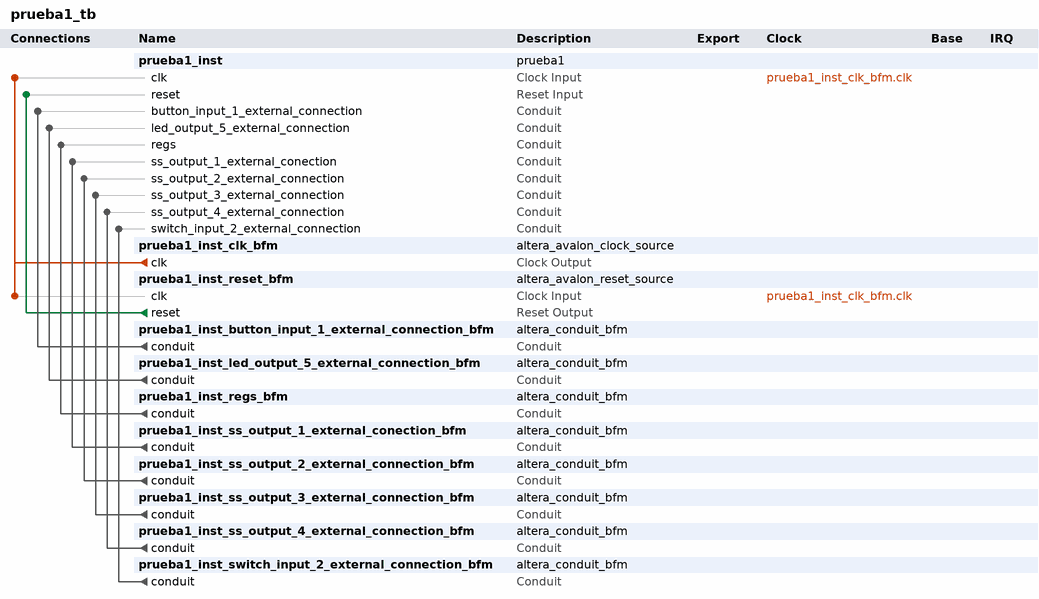
[diagram p0: system contents]
# Platform Designer (Qsys) system prueba1_tb, Cyclone V 5CEBA2F17A7
# Parameters at their usual value, and those the tool derives, are not listed.
package require -exact qsys 19.1
create_system prueba1_tb
set_project_property DEVICE_FAMILY {Cyclone V}
set_project_property DEVICE 5CEBA2F17A7

add_instance prueba1_inst prueba1 1.0

add_instance prueba1_inst_clk_bfm altera_avalon_clock_source 19.1

add_instance prueba1_inst_reset_bfm altera_avalon_reset_source 19.1
set_instance_parameter_value prueba1_inst_reset_bfm ASSERT_HIGH_RESET 0
set_instance_parameter_value prueba1_inst_reset_bfm INITIAL_RESET_CYCLES 50

add_instance prueba1_inst_button_input_1_external_connection_bfm altera_conduit_bfm 19.1
set_instance_parameter_value prueba1_inst_button_input_1_external_connection_bfm CLOCKED_SIGNAL false
set_instance_parameter_value prueba1_inst_button_input_1_external_connection_bfm ENABLE_RESET false
set_instance_parameter_value prueba1_inst_button_input_1_external_connection_bfm SIGNAL_DIRECTIONS output
set_instance_parameter_value prueba1_inst_button_input_1_external_connection_bfm SIGNAL_WIDTHS 3

add_instance prueba1_inst_led_output_5_external_connection_bfm altera_conduit_bfm 19.1
set_instance_parameter_value prueba1_inst_led_output_5_external_connection_bfm CLOCKED_SIGNAL false
set_instance_parameter_value prueba1_inst_led_output_5_external_connection_bfm ENABLE_RESET false
set_instance_parameter_value prueba1_inst_led_output_5_external_connection_bfm SIGNAL_DIRECTIONS input
set_instance_parameter_value prueba1_inst_led_output_5_external_connection_bfm SIGNAL_WIDTHS 8

add_instance prueba1_inst_regs_bfm altera_conduit_bfm 19.1
set_instance_parameter_value prueba1_inst_regs_bfm CLOCKED_SIGNAL false
set_instance_parameter_value prueba1_inst_regs_bfm ENABLE_RESET false
set_instance_parameter_value prueba1_inst_regs_bfm SIGNAL_DIRECTIONS input
set_instance_parameter_value prueba1_inst_regs_bfm SIGNAL_WIDTHS 8

add_instance prueba1_inst_ss_output_1_external_conection_bfm altera_conduit_bfm 19.1
set_instance_parameter_value prueba1_inst_ss_output_1_external_conection_bfm CLOCKED_SIGNAL false
set_instance_parameter_value prueba1_inst_ss_output_1_external_conection_bfm ENABLE_RESET false
set_instance_parameter_value prueba1_inst_ss_output_1_external_conection_bfm SIGNAL_DIRECTIONS input
set_instance_parameter_value prueba1_inst_ss_output_1_external_conection_bfm SIGNAL_WIDTHS 8

add_instance prueba1_inst_ss_output_2_external_connection_bfm altera_conduit_bfm 19.1
set_instance_parameter_value prueba1_inst_ss_output_2_external_connection_bfm CLOCKED_SIGNAL false
set_instance_parameter_value prueba1_inst_ss_output_2_external_connection_bfm ENABLE_RESET false
set_instance_parameter_value prueba1_inst_ss_output_2_external_connection_bfm SIGNAL_DIRECTIONS input
set_instance_parameter_value prueba1_inst_ss_output_2_external_connection_bfm SIGNAL_WIDTHS 8

add_instance prueba1_inst_ss_output_3_external_connection_bfm altera_conduit_bfm 19.1
set_instance_parameter_value prueba1_inst_ss_output_3_external_connection_bfm CLOCKED_SIGNAL false
set_instance_parameter_value prueba1_inst_ss_output_3_external_connection_bfm ENABLE_RESET false
set_instance_parameter_value prueba1_inst_ss_output_3_external_connection_bfm SIGNAL_DIRECTIONS input
set_instance_parameter_value prueba1_inst_ss_output_3_external_connection_bfm SIGNAL_WIDTHS 8

add_instance prueba1_inst_ss_output_4_external_connection_bfm altera_conduit_bfm 19.1
set_instance_parameter_value prueba1_inst_ss_output_4_external_connection_bfm CLOCKED_SIGNAL false
set_instance_parameter_value prueba1_inst_ss_output_4_external_connection_bfm ENABLE_RESET false
set_instance_parameter_value prueba1_inst_ss_output_4_external_connection_bfm SIGNAL_DIRECTIONS input
set_instance_parameter_value prueba1_inst_ss_output_4_external_connection_bfm SIGNAL_WIDTHS 8

add_instance prueba1_inst_switch_input_2_external_connection_bfm altera_conduit_bfm 19.1
set_instance_parameter_value prueba1_inst_switch_input_2_external_connection_bfm CLOCKED_SIGNAL false
set_instance_parameter_value prueba1_inst_switch_input_2_external_connection_bfm ENABLE_RESET false
set_instance_parameter_value prueba1_inst_switch_input_2_external_connection_bfm SIGNAL_DIRECTIONS output
set_instance_parameter_value prueba1_inst_switch_input_2_external_connection_bfm SIGNAL_WIDTHS 3

# connections
add_connection prueba1_inst_clk_bfm.clk prueba1_inst.clk clock
add_connection prueba1_inst_clk_bfm.clk prueba1_inst_reset_bfm.clk clock
add_connection prueba1_inst_reset_bfm.reset prueba1_inst.reset reset
add_connection prueba1_inst_button_input_1_external_connection_bfm.conduit prueba1_inst.button_input_1_external_connection conduit
add_connection prueba1_inst_led_output_5_external_connection_bfm.conduit prueba1_inst.led_output_5_external_connection conduit
add_connection prueba1_inst_regs_bfm.conduit prueba1_inst.regs conduit
add_connection prueba1_inst_ss_output_1_external_conection_bfm.conduit prueba1_inst.ss_output_1_external_conection conduit
add_connection prueba1_inst_ss_output_2_external_connection_bfm.conduit prueba1_inst.ss_output_2_external_connection conduit
add_connection prueba1_inst_ss_output_3_external_connection_bfm.conduit prueba1_inst.ss_output_3_external_connection conduit
add_connection prueba1_inst_ss_output_4_external_connection_bfm.conduit prueba1_inst.ss_output_4_external_connection conduit
add_connection prueba1_inst_switch_input_2_external_connection_bfm.conduit prueba1_inst.switch_input_2_external_connection conduit

set_interconnect_requirement {$system} qsys_mm.clockCrossingAdapter HANDSHAKE
set_interconnect_requirement {$system} qsys_mm.enableEccProtection FALSE
set_interconnect_requirement {$system} qsys_mm.insertDefaultSlave FALSE
set_interconnect_requirement {$system} qsys_mm.maxAdditionalLatency 1

save_system prueba1_tb.qsys
